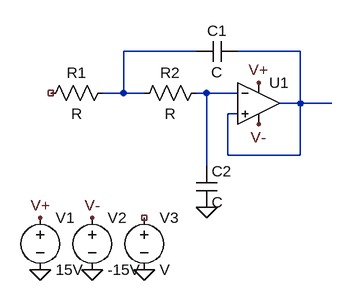
[diagram p0: schematic 2-2.asc]
2-2.asc, the LTspice schematic file:
Version 4
SHEET 1 880 680
WIRE 288 80 176 80
WIRE 448 80 352 80
WIRE 176 144 176 80
WIRE 176 144 144 144
WIRE 208 144 176 144
WIRE 304 144 288 144
WIRE 352 144 304 144
WIRE 448 160 448 80
WIRE 448 160 416 160
WIRE 496 160 448 160
WIRE 352 176 336 176
WIRE 336 240 336 176
WIRE 448 240 448 160
WIRE 448 240 336 240
WIRE 304 256 304 144
FLAG 128 416 0
FLAG 48 416 0
FLAG 208 416 0
FLAG 48 336 V+
FLAG 128 336 V-
FLAG 384 192 V-
FLAG 384 128 V+
FLAG 304 320 0
SYMBOL res 160 128 R90
WINDOW 0 0 56 VBottom 2
WINDOW 3 32 56 VTop 2
SYMATTR InstName R1
SYMBOL res 304 128 R90
WINDOW 0 0 56 VBottom 2
WINDOW 3 32 56 VTop 2
SYMATTR InstName R2
SYMBOL OpAmps\\UniversalOpAmp2 384 160 R0
SYMATTR InstName U1
SYMBOL voltage 48 320 R0
SYMATTR InstName V1
SYMATTR Value 15V
SYMBOL voltage 128 320 R0
SYMATTR InstName V2
SYMATTR Value -15V
SYMBOL voltage 208 320 R0
SYMATTR InstName V3
SYMBOL cap 352 64 R90
WINDOW 0 0 32 VBottom 2
WINDOW 3 32 32 VTop 2
SYMATTR InstName C1
SYMBOL cap 288 256 R0
SYMATTR InstName C2

The netlist it stands for:
* 2-2.asc
R1 N001 NC_01 R
R2 N003 N001 R
XU1 N002 N003 V+ V- N002 level2 Avol=1Meg GBW=10Meg Slew=10Meg Ilimit=25m Rail=0 Vos=0 En=0 Enk=0 In=0 Ink=0 Rin=500Meg  ; pins In+ In- V+ V- OUT
V1 V+ 0 15V
V2 V- 0 -15V
V3 NC_02 0 V
C1 N002 N001 C
C2 N003 0 C
.lib UniversalOpAmp2.lib
.backanno
.end